# Altium schematic sheet Control Interface.SchDoc: Control Interface
size Tabloid; CompanyName: Vertex; Organization: Vertex Downhole Ltd.; Address1: 10911 50th Street SE; Address2: Calgary, AB; Address3: T2C 3E5; Address4: Canada; DocumentNumber: 550014; Revision: 4.1; SheetNumber: 2; SheetTotal: 8
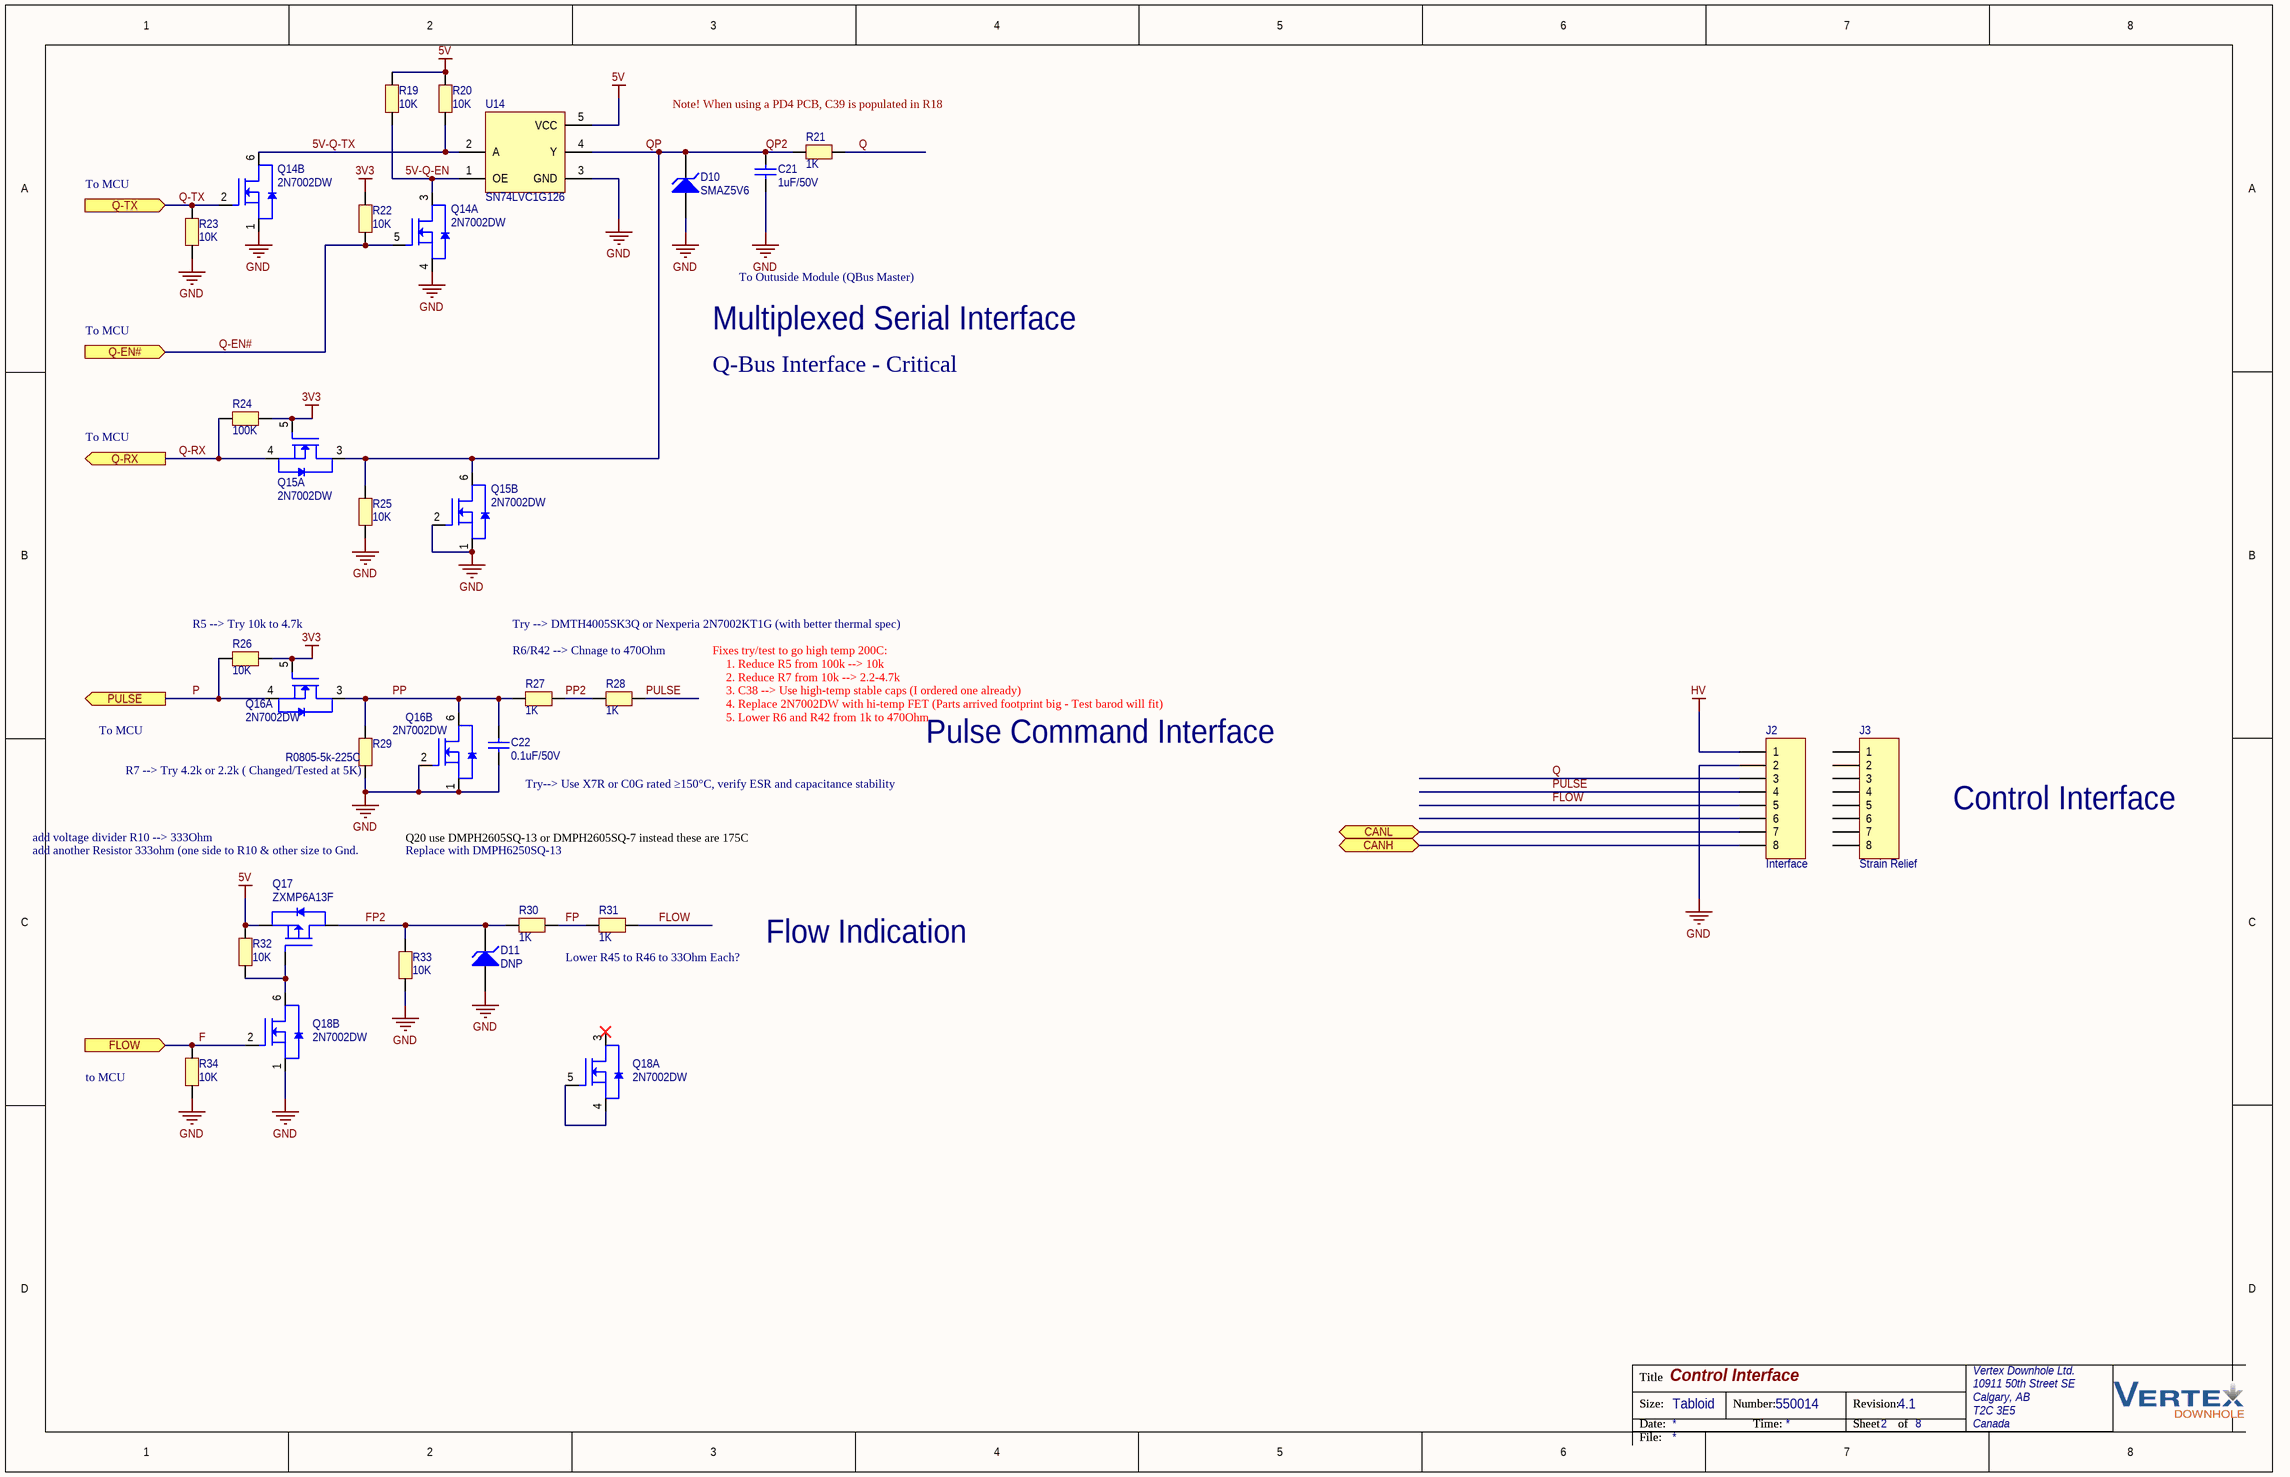
[diagram p0: Control Interface.SchDoc]

## Parts
C21  1uF/50V  [0805-CR]
C22  0.1uF/50V  [0805-CR]
D10  SMAZ5V6  [SMA]
D11  DNP  [SMA]
J2  Interface  [HDR1X8]
J3  Strain Relief  [HDR1X8]
Q14  2N7002DW  [DCK-6]  (parts A,B of 2)
Q15  2N7002DW  [DCK-6]  (parts A,B of 2)
Q16  2N7002DW  [DCK-6]  (parts A,B of 2)
Q17  ZXMP6A13F  [DGS]
Q18  2N7002DW  [DCK-6]  (parts A,B of 2)
R19  10K  [0805-CR]
R20  10K  [0805-CR]
R21  1K  [0805-CR]
R22  10K  [0805-CR]
R23  10K  [0805-CR]
R24  100K  [0805-CR]
R25  10K  [0805-CR]
R26  10K  [0805-CR]
R27  1K  [0805-CR]
R28  1K  [0805-CR]
R29  R0805-5k-225C  [0805]
R30  1K  [0805-CR]
R31  1K  [0805-CR]
R32  10K  [0805-CR]
R33  10K  [0805-CR]
R34  10K  [0805-CR]
U14  SN74LVC1G126  [DBV-5]

## Ports
CANH (bidir), CANL (bidir), FLOW (in), PULSE (out), Q-EN# (in), Q-RX (out), Q-TX (in)

## Nets
3V3: Q15.5(G1) Q16.5(G1) R22.1 R24.2 R26.1
5V: Q17.2(S) R19.1 R20.1 R32.1 U14.5(VCC)
GND: C21.1 C22.2 D10.1(A) D11.1(A) J2.2 Q14.1(S2) Q14.4(S1) Q15.1(S2) Q15.2(G2) Q16.1(S2) Q16.2(G2) Q18.1(S2) R23.2 R25.2 R29.2 R33.2 R34.2 U14.3(GND)
HV: J2.1
5V-Q-EN: Q14.3(D1) R19.2 U14.1(OE)
5V-Q-TX: Q14.6(D2) R20.2 U14.2(A)
CANH: J2.8 ; port CANH
CANL: J2.7 ; port CANL
F: Q18.2(G2) R34.1 ; port FLOW
FLOW: J2.5 R31.2
FP: R30.2 R31.1
FP2: D11.2(K) Q17.3(D) R30.1 R33.1
P: Q16.4(S1) R26.2 ; port PULSE
PP: C22.1 Q16.3(D1) Q16.6(D2) R27.1 R29.1
PP2: R27.2 R28.1
PULSE: J2.4 R28.2
Q: J2.3 R21.2
Q-EN#: Q14.5(G1) R22.2 ; port Q-EN#
Q-RX: Q15.4(S1) R24.1 ; port Q-RX
Q-TX: Q14.2(G2) R23.1 ; port Q-TX
QP: C21.2 D10.2(K) Q15.3(D1) Q15.6(D2) R21.1 R25.1 U14.4(Y)  [also labelled QP2]
NetQ17_1: Q17.1(G) Q18.6(D2) R32.2
NetQ18_4: Q18.4(S1) Q18.5(G1)

Not connected (* = marked no-connect by the designer): J2 6; J3 1 2 3 4 5 6 7 8; Q18 3(D1)*

## Notes on the sheet
- Note! When using a PD4 PCB, C39 is populated in R18
- To MCU
- To Outuside Module (QBus Master)
- Multiplexed Serial Interface
- Q-Bus Interface - Critical
- R5 --> Try 10k to 4.7k
- Try --> DMTH4005SK3Q or Nexperia 2N7002KT1G (with better thermal spec)
- R6/R42 --> Chnage to 470Ohm
- Fixes try/test to go high temp 200C:
- 1. Reduce R5 from 100k --> 10k
- 2. Reduce R7 from 10k --> 2.2-4.7k
- 3. C38 --> Use high-temp stable caps (I ordered one already)
- 4. Replace 2N7002DW with hi-temp FET (Parts arrived footprint big - Test barod will fit)
- 5. Lower R6 and R42 from 1k to 470Ohm
- Pulse Command Interface
- (near R29) R7 --> Try 4.2k or 2.2k ( Changed/Tested at 5K)
- (near C22) Try--> Use X7R or C0G rated ≥150°C, verify ESR and capacitance stability
- Control Interface
- add voltage divider R10 --> 333Ohm
- add another Resistor 333ohm (one side to R10 & other size to Gnd.
- Replace with DMPH6250SQ-13
- Q20 use DMPH2605SQ-13 or DMPH2605SQ-7 instead these are 175C
- Lower R45 to R46 to 33Ohm Each?
- Flow Indication
- to MCU
- Title
- Size:
- Date:
- Tabloid
- Number:
- Time:
- Revision:
- Sheet
- of
- File:

## Library data of the parts
C21 = Cap: Capacitor; Manufacturer: TDK; Vendor: Digi-Key; Vendor PN: 445-CGA4J1X8L1H105K125ACCT-ND; Manu PN: CGA4J1X8L1H105K125AC; Vertex PN: TBD
C22 = Cap: Capacitor; Manufacturer: Murata Electronics North America; Vendor: Digi-Key; Vendor PN: 490-1666-1-ND; Manu PN: GRM21BR71H104KA01L; Vertex PN: 6280000
D10 D11 = D Zener: SMAZ5V6 5.6V Zener Diode; Manufacturer: Diodes Inc; Vendor: Digi-Key; Vendor PN: SMAZ5V6-FDICT-ND; Manu PN: SMAZ5V6-13-F; Vertex PN: 6600005
J2 J3 = Header 8: Header, 8-Pin
Q14-Q16 Q18 = 2N7002DW: 2N7002DW Dual N-Channel FET SC-70-6; Manufacturer: Fairchild Semiconductor; Vendor PN: 2N7002DWCT-ND; Vendor: Digi-Key; Vertex PN: 6500000; Manu PN: 2N7002DW
Q17 = Si2323DS: ZXMP6A13F 60V P-channel FET; Manufacturer: Diodes/Zetex; Manu PN: ZXMP6A13FTA; Vendor: Digi-Key; Vendor PN: ZXMP6A13FCT-ND; Vertex PN: 6500003
R19 R20 R22 R23 R25 R26 R32-R34 = RES: Resistor; Manufacturer: Yageo; Vendor PN: 311-10.0KCRCT-ND; Vendor: Digi-Key; Manu PN: RC0805FR-0710KL; Vertex PN: 6181002
R21 R27 R28 R30 R31 = RES: Resistor; Manufacturer: Yageo; Vendor PN: 311-1.00KCRCT-ND; Vendor: Digi-Key; Manu PN: RC0805FR-071KL; Vertex PN: 6180102
R24 = RES: Resistor; Manufacturer: Yageo; Vendor PN: 311-100KCRCT-ND; Vendor: Digi-Key; Manu PN: RC0805FR-07100KL; Vertex PN: 6181003
R29 = RES: Resistor; Manufacturer: VPG Foil Resistors; Vendor PN: Y4062-5.0KACT-ND; Vendor: Digi-Key; Manu PN: Y40625K00000Q0R
U14 = SN74LVC1G126: SN74LVC1G126DBV Tri-state Buffer (Non-Inverting OE); Manufacturer: Texas Instruments; Vendor: Digi-Key; Vendor PN: 296-11605-1-ND; Manu PN: SN74LVC1G126DBVR; Vertex PN: 6400024